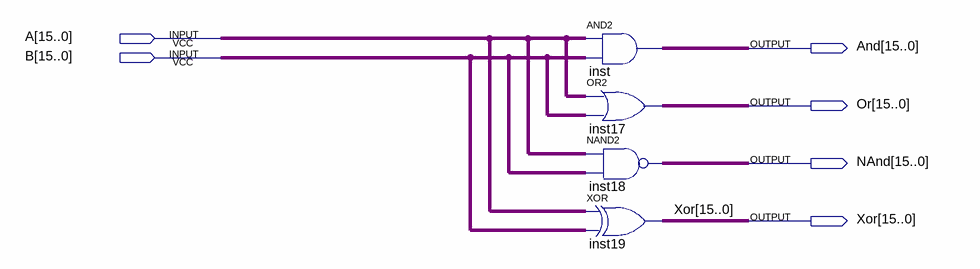
[diagram p0: schematic sheet]
// Quartus schematic Logic.bdf as structural Verilog: 4 symbols, 6 pins
module Logic (
  input  [15:0] A,
  input  [15:0] B,
  output [15:0] And,
  output [15:0] Or,
  output [15:0] NAnd,
  output [15:0] Xor
);

  assign And = A & B;  // AND2 inst, 16 bits wide
  assign Or = A | B;  // OR2 inst17, 16 bits wide
  assign NAnd = ~(A & B);  // NAND2 inst18, 16 bits wide
  assign Xor = A ^ B;  // XOR inst19, 16 bits wide
endmodule
